# Altium schematic sheet H3_USB.SchDoc
size A4
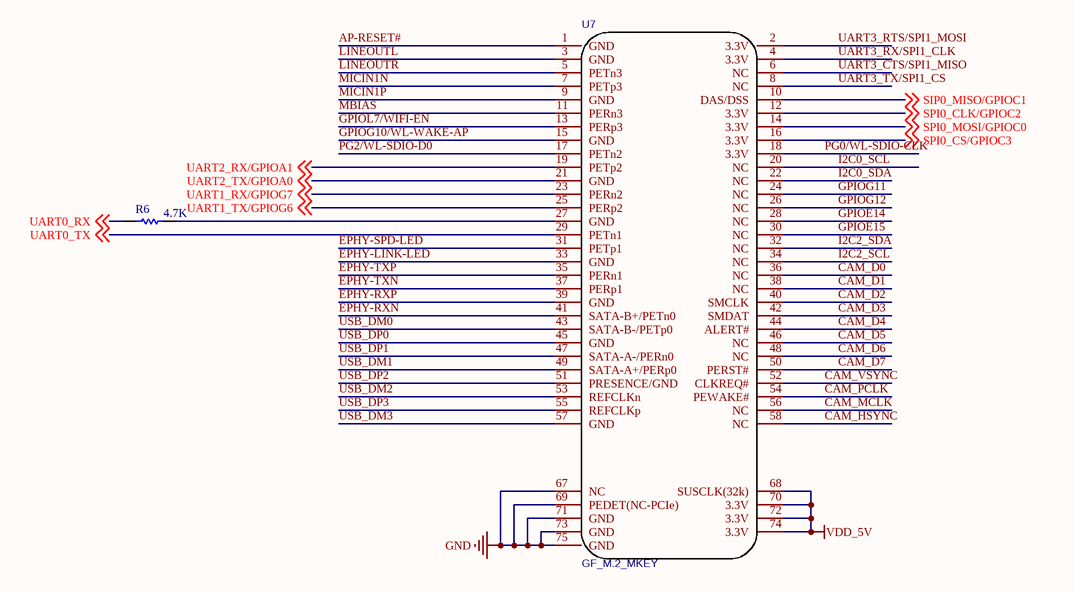
[diagram p0: H3_USB.SchDoc]

## Parts
R6  4.7K  [R0402]
U7  GF_M.2_MKEY  [GF_M.2_M_KEY]

## Nets
GND: U7.67(NC) U7.69(PEDET(NC-PCIe)) U7.71(GND) U7.73(GND) U7.75(GND)
VDD_5V: U7.68(SUSCLK(32k)) U7.70(3.3V) U7.72(3.3V) U7.74(3.3V)
AP-RESET#: U7.1(GND)
CAM_D0: U7.36(NC)
CAM_D1: U7.38(NC)
CAM_D2: U7.40(SMCLK)
CAM_D3: U7.42(SMDAT)
CAM_D4: U7.44(ALERT#)
CAM_D5: U7.46(NC)
CAM_D6: U7.48(NC)
CAM_D7: U7.50(PERST#)
CAM_HSYNC: U7.58(NC)
CAM_MCLK: U7.56(NC)
CAM_PCLK: U7.54(PEWAKE#)
CAM_VSYNC: U7.52(CLKREQ#)
EPHY-LINK-LED: U7.33(GND)
EPHY-RXN: U7.41(SATA-B+/PETn0)
EPHY-RXP: U7.39(GND)
EPHY-SPD-LED: U7.31(PETp1)
EPHY-TXN: U7.37(PERp1)
EPHY-TXP: U7.35(PERn1)
GPIOE14: U7.28(NC)
GPIOE15: U7.30(NC)
GPIOG10/WL-WAKE-AP: U7.15(GND)
GPIOG11: U7.24(NC)
GPIOG12: U7.26(NC)
GPIOL7/WIFI-EN: U7.13(PERp3)
I2C0_SCL: U7.20(NC)
I2C0_SDA: U7.22(NC)
I2C2_SCL: U7.34(NC)
I2C2_SDA: U7.32(NC)
LINEOUTL: U7.3(GND)
LINEOUTR: U7.5(PETn3)
MBIAS: U7.11(PERn3)
MICIN1N: U7.7(PETp3)
MICIN1P: U7.9(GND)
PG0/WL-SDIO-CLK: U7.18(3.3V)
PG2/WL-SDIO-D0: U7.17(PETn2)
SIP0_MISO/GPIOC1: U7.10(DAS/DSS) ; off-sheet SIP0_MISO/GPIOC1
SPI0_CLK/GPIOC2: U7.12(3.3V) ; off-sheet SPI0_CLK/GPIOC2
SPI0_CS/GPIOC3: U7.16(3.3V) ; off-sheet SPI0_CS/GPIOC3
SPI0_MOSI/GPIOC0: U7.14(3.3V) ; off-sheet SPI0_MOSI/GPIOC0
UART0_RX: R6.2 ; off-sheet UART0_RX
UART0_TX: U7.29(PETn1) ; off-sheet UART0_TX
UART1_RX/GPIOG7: U7.23(PERn2) ; off-sheet UART1_RX/GPIOG7
UART1_TX/GPIOG6: U7.25(PERp2) ; off-sheet UART1_TX/GPIOG6
UART2_RX/GPIOA1: U7.19(PETp2) ; off-sheet UART2_RX/GPIOA1
UART2_TX/GPIOA0: U7.21(GND) ; off-sheet UART2_TX/GPIOA0
UART3_CTS/SPI1_MISO: U7.6(NC)
UART3_RTS/SPI1_MOSI: U7.2(3.3V)
UART3_RX/SPI1_CLK: U7.4(3.3V)
UART3_TX/SPI1_CS: U7.8(NC)
USB_DM0: U7.43(SATA-B-/PETp0)
USB_DM1: U7.49(SATA-A+/PERp0)
USB_DM2: U7.53(REFCLKn)
USB_DM3: U7.57(GND)
USB_DP0: U7.45(GND)
USB_DP1: U7.47(SATA-A-/PERn0)
USB_DP2: U7.51(PRESENCE/GND)
USB_DP3: U7.55(REFCLKp)
NetR6_1: R6.1 U7.27(GND)

## Library data of the parts
R6 = RES0402: 电阻; Published: 8-Jun-2000; LatestRevisionDate: 17-Jul-2002; LatestRevisionNote: Re-released for DXP Platform.; PackageReference: AXIAL-0.3; Publisher: Altium Limited; PackageDescription: Axial Device, Thru-Hole; 2 Leads; 0.3 in Pin Spacing
U7 = GF_M.2_MKEY: BOM_Manufacturer: SHOWNAME=F; Contributor: redgragon; BOM_Manufacturer Part: SHOWNAME=F; BOM_Supplier Part: SHOWNAME=F; BOM_Supplier: SHOWNAME=F; link: SHOWNAME=F; spicePre: U; spiceSymbolName: GF_M.2_MKEY